# EasyEDA schematic smart doorbell.json
TITLE: Sheet_1; REV: 1.0; Date: 2024-07-31; Sheet: 1/1; Company: Your Company
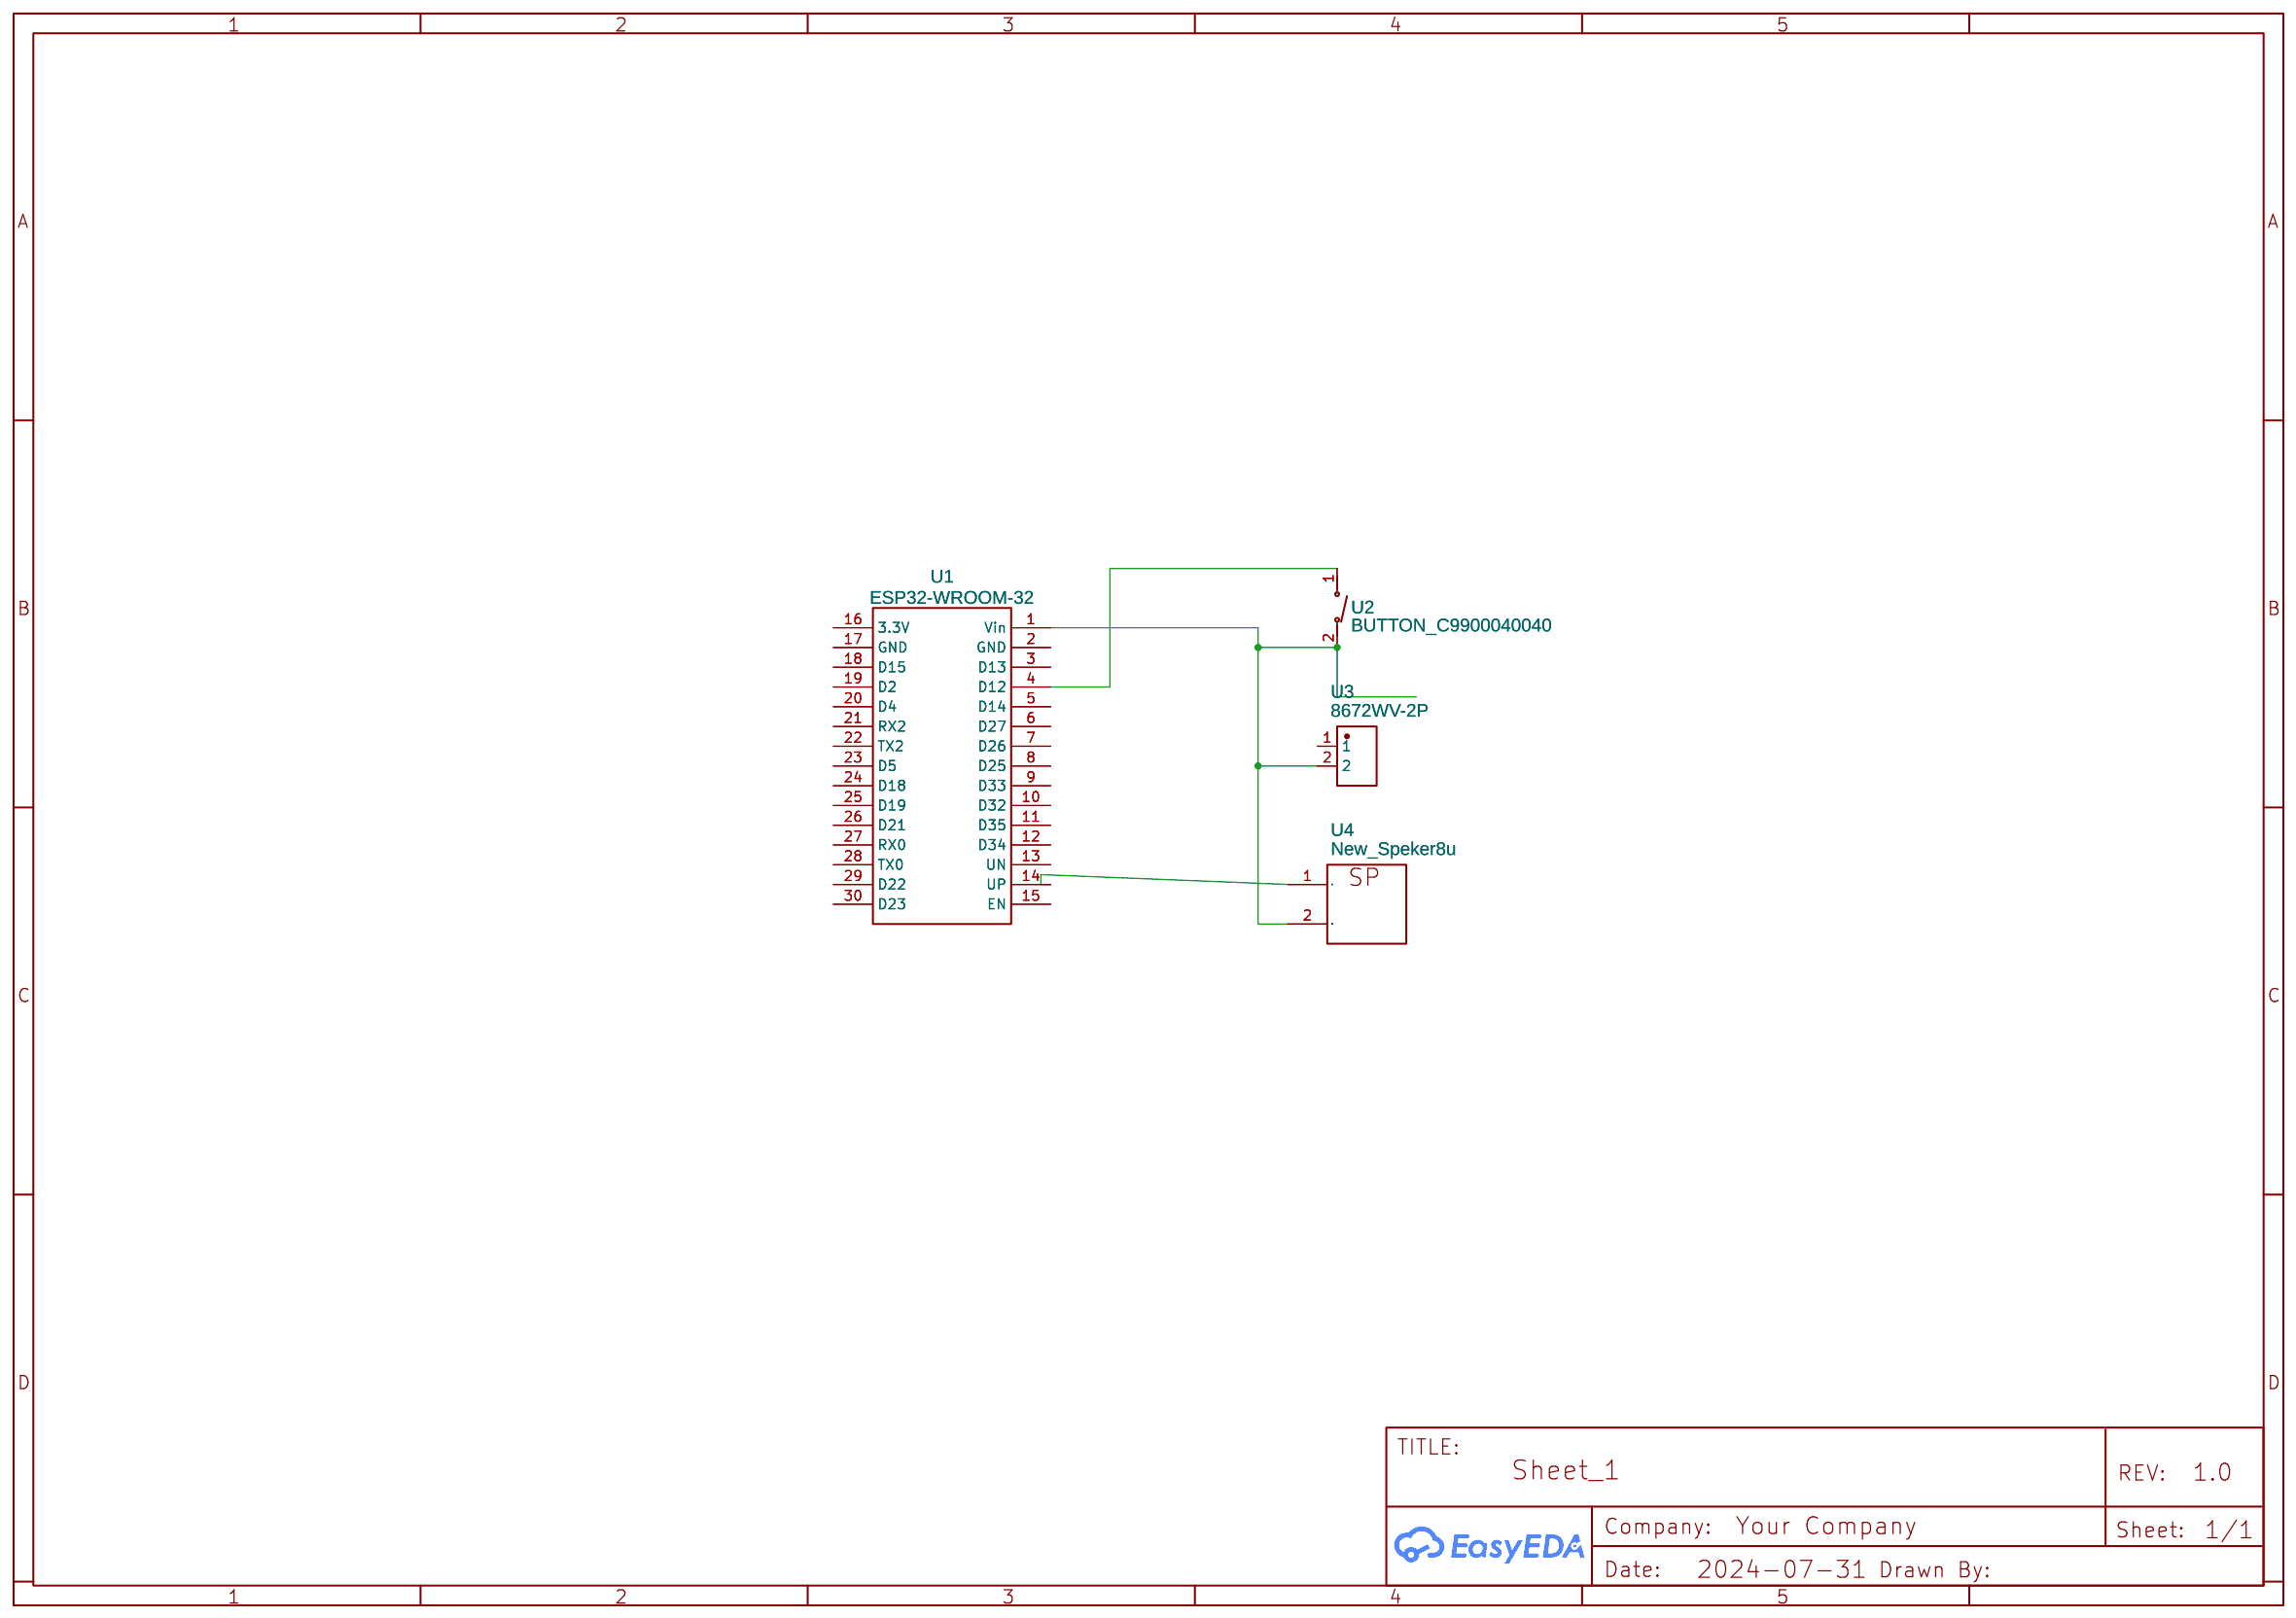
[diagram p0: schematic sheet]

## Parts
U1  ESP32-WROOM-32  [ESP32-WROOM-32]
U2  BUTTON_C9900040040  [KEY-SMD_L6.0-W6.0-LS6.6]
U3  8672WV-2P  [CONN-TH_HANELECTRICITY_8672WV-2P]
U4  New_Speker8u

## Library data of the parts
U1 = ESP32-WROOM-32: Manufacturer: Espressif; Supplier: Espressif; link: https://www.espressif.com/sites/default/files/documentation/esp32_datasheet_en.pdf; Contributor: li_necont
U2 = BUTTON_C9900040040: Contributor: lcsc; Supplier: LCSC; Supplier Part: C9900040040; Manufacturer: null; Manufacturer Part: BUTTON; JLCPCB Part Class: Extended Part
U3 = 8672WV-2P: Supplier: LCSC; Supplier Part: C19188574; Manufacturer: HanElectricity(瀚源); Contributor: lcsc
U4 = New_Speker8u: Manufacturer Part: speker; Contributor: Didok98

## Nets
Net-(U1-1): U1.1(Vin) U2.2(B) U3.2 U4.2
Net-(U1-4): U1.4(D12) U2.1(A)
Net-(U1-14): U1.14(UP) U4.1

Not connected (* = marked no-connect by the designer): U1 2(GND) 3(D13) 5(D14) 6(D27) 7(D26) 8(D25) 9(D33) 10(D32) 11(D35) 12(D34) 13(UN) 15(EN) 16(3.3V) 17(GND) 18(D15) 19(D2) 20(D4) 21(RX2) 22(TX2) 23(D5) 24(D18) 25(D19) 26(D21) 27(RX0) 28(TX0) 29(D22) 30(D23); U3 1
